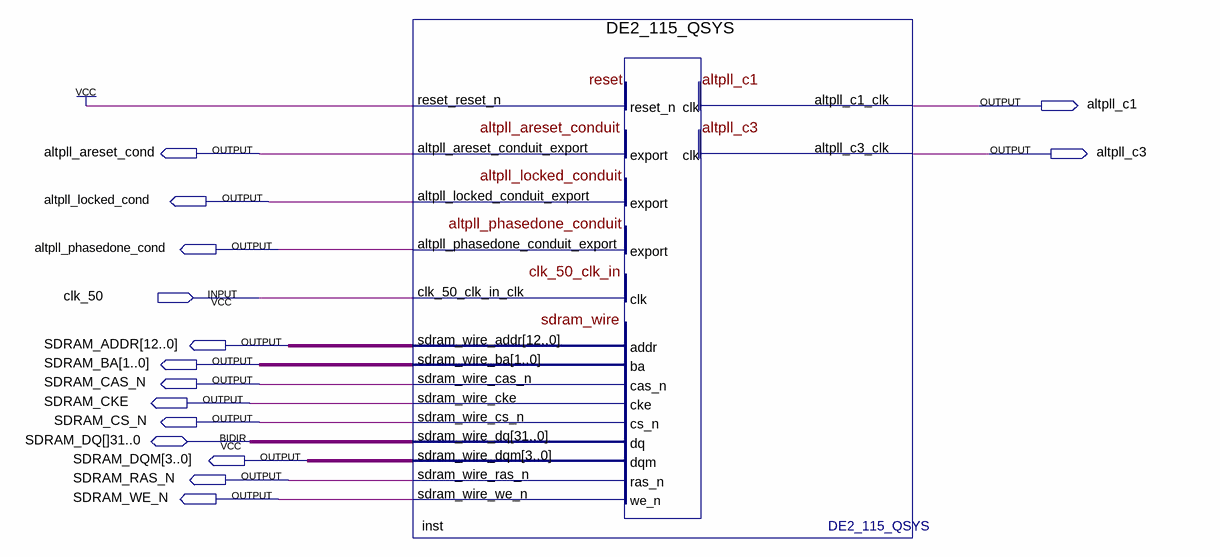
[diagram p0: schematic sheet]
// Quartus schematic TopLevel.bdf as structural Verilog: 1 symbols, 15 pins
module TopLevel (
  input  clk_50,
  inout  \SDRAM_DQ[]31..0 ,
  output altpll_c1,
  output altpll_areset_cond,
  output altpll_c3,
  output altpll_locked_cond,
  output altpll_phasedone_cond,
  output [12:0] SDRAM_ADDR,
  output [1:0] SDRAM_BA,
  output SDRAM_CAS_N,
  output SDRAM_CKE,
  output SDRAM_CS_N,
  output [3:0] SDRAM_DQM,
  output SDRAM_RAS_N,
  output SDRAM_WE_N
);

  wire [31:0] inst_sdram_wire_dq;

  DE2_115_QSYS inst (
    .reset_reset_n(1'b1), .altpll_areset_conduit_export(altpll_areset_cond), .clk_50_clk_in_clk(clk_50),
    .altpll_locked_conduit_export(altpll_locked_cond),
    .altpll_phasedone_conduit_export(altpll_phasedone_cond), .altpll_c1_clk(altpll_c1),
    .sdram_wire_addr(SDRAM_ADDR), .sdram_wire_ba(SDRAM_BA), .sdram_wire_cas_n(SDRAM_CAS_N),
    .sdram_wire_cke(SDRAM_CKE), .sdram_wire_cs_n(SDRAM_CS_N), .sdram_wire_dqm(SDRAM_DQM),
    .sdram_wire_ras_n(SDRAM_RAS_N), .sdram_wire_we_n(SDRAM_WE_N), .altpll_c3_clk(altpll_c3),
    .sdram_wire_dq(inst_sdram_wire_dq));
endmodule
